# Altium schematic sheet OLED.SchDoc
size Legal; SheetNumber: 12; SheetTotal: 12
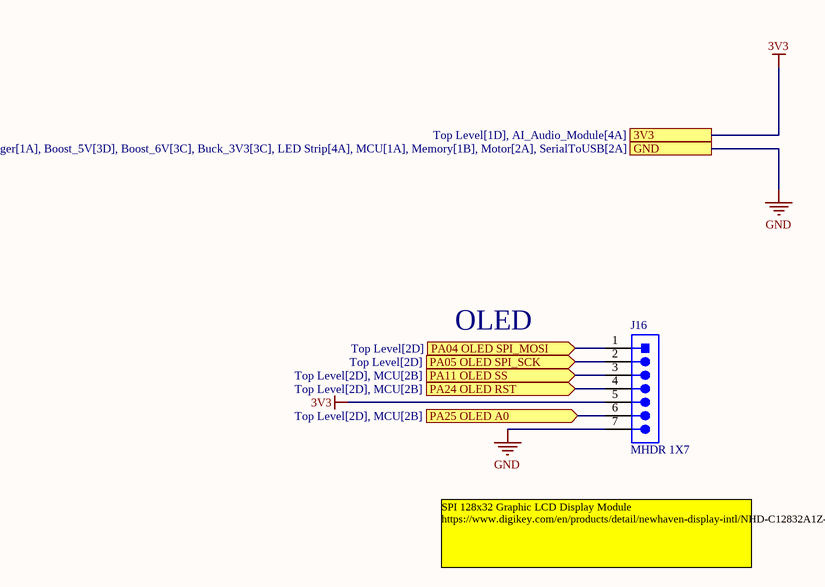
[diagram p0: OLED.SchDoc]

## Parts
J16  MHDR 1X7  [MHDR 1X7-Footprint-1]

## Ports
3V3 (see Top Level[1D], AI_Audio_Module[4A]), GND (see Top Level[1D], AI_Audio_Module[4A], BatteryCharger[1A], Boost_5V[3D], Boost_6V[3C], Buck_3V3[3C], LED Strip[4A], MCU[1A], Memory[1B], Motor[2A], SerialToUSB[2A]), PA04 OLED SPI_MOSI (in, see Top Level[2D]), PA05 OLED SPI_SCK (in, see Top Level[2D]), PA11 OLED SS (in, see Top Level[2D], MCU[2B]), PA24 OLED RST (in, see Top Level[2D], MCU[2B]), PA25 OLED A0 (in, see Top Level[2D], MCU[2B])

## Nets
3V3: J16.5 ; port 3V3
GND: J16.7 ; port GND
PA04 OLED SPI_MOSI: J16.1 ; port PA04 OLED SPI_MOSI
PA05 OLED SPI_SCK: J16.2 ; port PA05 OLED SPI_SCK
PA11 OLED SS: J16.3 ; port PA11 OLED SS
PA24 OLED RST: J16.4 ; port PA24 OLED RST
PA25 OLED A0: J16.6 ; port PA25 OLED A0

## Notes on the sheet
- OLED
- SPI 128x32 Graphic LCD Display Module
  https://www.digikey.com/en/products/detail/newhaven-display-intl/NHD-C12832A1Z-FSW-FBW-3V3/2059236?s=N4IgTCBcDaIHIAkAiBaAwgRjADgMxgEEMAtFAMQGUB1cgIRtwDVcU4kQBdAXyA
- Title:
- Desc:
- Size:
- Letter
- Auth:
- Proj:
- Sheet
- of
- www.seas.upenn.edu
- Electrical and Systems Engineering

## Library data of the parts
J16 = CMP-00373-1: Header, 7-Pin, 0.1in Pitch, Male; Contact Pattern: RECTANGULAR; Body Length: 0.7inch; Reliability: COMMERCIAL; Number of Contacts: 7; Insulation Resistance: 1GR; Mounting Option 1: LOCKING; Mating Contact Pitch: 0.1inch; Reference Standard: UL; Rated Current (Signal): 3A; Connector Type: BOARD CONNECTOR; Dielectric Withstanding Voltage (AC): 500V; Body/Shell Style: PLUG; Contact Style: SQ PIN-SKT; Number of Rows Loaded: 1; Contact Resistance: 20mR; Min Operating Temperature: -40°C; Contact Gender: Male; Contact Finish - Termination: Gold (Au) - with Nickel (Ni) barrier; Terminal Pitch: 2.54mm; Insulation Material: Polybutylene; Contact Finish - Mating: GOLD; JESD-609 Code: e4; Body Breadth: 0.1inch; Contact Material: Copper Alloy; Mounting Technology: Board; Terminal Length: 0.118inch; Insulation Color: Black; RoHS Compliant: Yes; Body Depth: 0.1inch; Mounting Style: STRAIGHT; PCB Contact Pattern: RECTANGULAR; Termination: Solder; Max Operating Temperature: 125°C; Number Of Connectors: 1; Reach SVHC Compliant: Yes